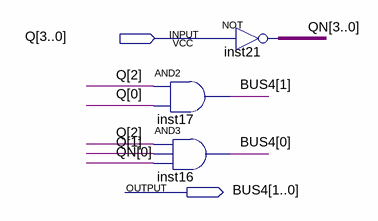
[diagram p0: schematic sheet]
// Quartus schematic BUS4.bdf as structural Verilog: 3 symbols, 2 pins
module BUS4 (
  input  [3:0] Q,
  output [1:0] BUS4
);

  wire [3:0] QN;

  and inst17 (BUS4[1], Q[2], Q[0]);
  and inst16 (BUS4[0], Q[2], Q[1], QN[0]);
  assign QN = ~Q;  // NOT inst21, 4 bits wide
endmodule
